# Altium schematic sheet Digital Input.SchDoc
size A; SheetNumber: 7; SheetTotal: 15
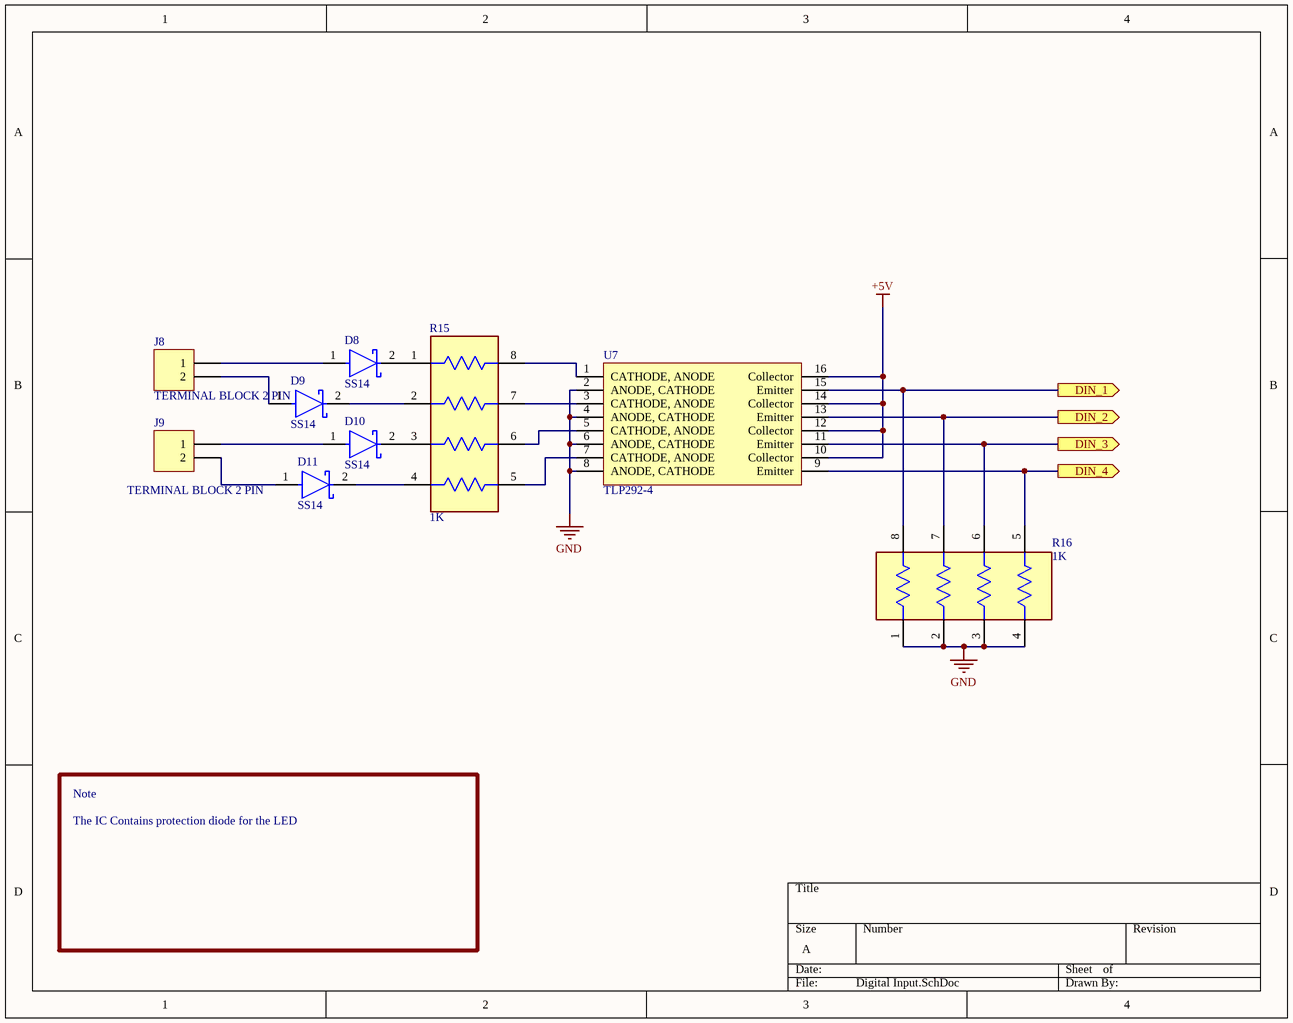
[diagram p0: Digital Input.SchDoc]

## Parts
D8  SS14  [FP-403AE-MFG]
D9  SS14  [FP-403AE-MFG]
D10  SS14  [FP-403AE-MFG]
D11  SS14  [FP-403AE-MFG]
J8  TERMINAL BLOCK 2 PIN  [CON2_P196_1729128_TH_ST]
J9  TERMINAL BLOCK 2 PIN  [CON2_P196_1729128_TH_ST]
R15  1K  [FP-YC164-MFG]
R16  1K  [FP-YC164-MFG]
U7  TLP292-4  [SOIC16_50_284_25X90_SMT]

## Ports
DIN_1 (out, see Block Diagram[6B]), DIN_2 (out, see Block Diagram[6B]), DIN_3 (out, see Block Diagram[6B]), DIN_4 (out, see Block Diagram[6B])

## Nets
+5V: U7.10(Collector) U7.12(Collector) U7.14(Collector) U7.16(Collector)
GND: R16.1 R16.2 R16.3 R16.4 U7.2(ANODE,_CATHODE) U7.4(ANODE,_CATHODE) U7.6(ANODE,_CATHODE) U7.8(ANODE,_CATHODE)
DIN_1: R16.8 U7.15(Emitter) ; port DIN_1
DIN_2: R16.7 U7.13(Emitter) ; port DIN_2
DIN_3: R16.6 U7.11(Emitter) ; port DIN_3
DIN_4: R16.5 U7.9(Emitter) ; port DIN_4
NetD8_1: D8.1(A) J8.1
NetD8_2: D8.2(C) R15.1
NetD9_1: D9.1(A) J8.2
NetD9_2: D9.2(C) R15.2
NetD10_1: D10.1(A) J9.1
NetD10_2: D10.2(C) R15.3
NetD11_1: D11.1(A) J9.2
NetD11_2: D11.2(C) R15.4
NetR15_5: R15.5 U7.7(CATHODE,_ANODE)
NetR15_6: R15.6 U7.5(CATHODE,_ANODE)
NetR15_7: R15.7 U7.3(CATHODE,_ANODE)
NetR15_8: R15.8 U7.1(CATHODE,_ANODE)

## Notes on the sheet
- Note
- The IC Contains protection diode for the LED

## Library data of the parts
D8-D11 = SS14: DIODE SCHOTTKY 40V 1A SMA; Manufacturer: ON Semiconductor; Peak Reverse Current: 0.2mA; Max Junction Temp: +125°C; Standoff Height: 0.05mm; Max Surge Forward Current: 40A; Mouser Description: Schottky Diodes & Rectifiers SMA 40V 1.0A; RoHS: TRUE; Lead Free: Yes; Manufacturer Part Number: SS14; Device Class L3: Schottky Diodes; Category: Diode; Automotive: No; Digikey Description: DIODE SCHOTTKY 40V 1A SMA; ComponentLink2Description: Datasheet; Device Class L2: Diodes; Height: 2.5mm; Temperature Range High: +125°C; ComponentLink2URL: https://www.onsemi.com/pub/Collateral/SS19-D.PDF; Device Class L1: Discrete Semiconductors; Package: 403AE; Octopart: https://octopart.com/ss14-on+semiconductor-29205033; Max Repetitive Reverse Voltage: 40V; Temperature Range Low: -65°C; Forward Current: 1A; Temperature: -65°C to +125°C
J8 J9 = CON-TB_2X1-196-ST-TH: 2 Pins, 1 Row 5mm Pitch, straight Connector, male; Manufacturer: Phoenix Contact; Manufacturer Part Number: MKDSN1,5/2; Alternate Part Number-1: NA; Case/Package: TH-CON; Supplier-1: SP ROAD; Supplier Part Number-1: MKDSN1,5/2
R15 R16 = Res-Array: RES ARRAY 4 RES 1K OHM 1206; Number of Terminals/Pins: 8; Resistance Tolerance: 5%; Temperature Coefficient: 200ppm/°C; Number of Circuits: 4; Resistance: 1kR; Power Per Element: 62.5mW; Voltage Rating: 50V; Circuit Type: Isolated; Case/Package: 0603; RoHS Compliant: Yes; Size Code: 0603; Tolerance: 5%; Min Operating Temperature: -55°C; Height: 0.028inch; Series: YC164; Number of Elements: 4; Length: 0.126inch; Number of Pins: 8; Number of Resistors: 4; Lead Free: Lead Free; Radiation Hardening: No; Max Operating Temperature: 155°C; Case Code (Metric): 3216; Working Voltage: 50V; Case Code (Imperial): 1206; Packaging: Cut Tape; Technology: THICK FILM; Number of Contacts: 8; Width: 0.063inch; Depth: 1.6mm; Terminal Pitch: 0.8mm; Power Dissipation: 62.5mW; Package Quantity: 1; Termination: Convex; Mount: Surface Mount; Military Standard: Not
U7 = TLP292-4: Optoisolator Transistor Output 3750Vrms 4 Channel 16-SO; Manufacturer: Olimex; Manufacturer Part Number: CH340C; Alternate Part Number-1: NA; Case/Package: SOIC16; Supplier-1: LCSC; Supplier Part Number-1: C84681